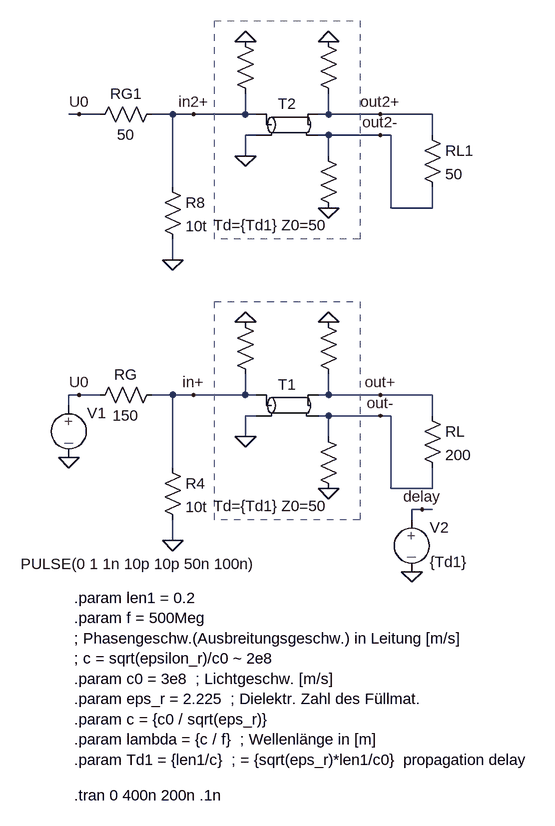
[diagram p0: schematic fehlanpassung_gustrau_S107.asc]
fehlanpassung_gustrau_S107.asc, the LTspice schematic file:
Version 4
SHEET 1 964 728
WIRE 128 -336 112 -336
WIRE 160 -336 128 -336
WIRE 272 -336 240 -336
WIRE 304 -336 272 -336
WIRE 384 -336 384 -368
WIRE 384 -336 304 -336
WIRE 400 -336 384 -336
WIRE 512 -336 512 -368
WIRE 512 -336 496 -336
WIRE 592 -336 512 -336
WIRE 672 -336 592 -336
WIRE 400 -304 384 -304
WIRE 512 -304 496 -304
WIRE 592 -304 512 -304
WIRE 608 -304 592 -304
WIRE 672 -304 672 -336
WIRE 384 -272 384 -304
WIRE 512 -272 512 -304
WIRE 272 -224 272 -336
WIRE 608 -192 608 -304
WIRE 672 -192 672 -224
WIRE 672 -192 608 -192
WIRE 272 -112 272 -144
WIRE 128 96 112 96
WIRE 160 96 128 96
WIRE 272 96 240 96
WIRE 304 96 272 96
WIRE 384 96 384 64
WIRE 384 96 304 96
WIRE 400 96 384 96
WIRE 512 96 512 64
WIRE 512 96 496 96
WIRE 592 96 512 96
WIRE 672 96 592 96
WIRE 112 112 112 96
WIRE 400 128 384 128
WIRE 512 128 496 128
WIRE 592 128 512 128
WIRE 608 128 592 128
WIRE 672 128 672 96
WIRE 384 160 384 128
WIRE 512 160 512 128
WIRE 272 208 272 96
WIRE 608 240 608 128
WIRE 672 240 672 208
WIRE 672 240 608 240
WIRE 656 272 640 272
WIRE 672 272 656 272
WIRE 640 288 640 272
WIRE 272 320 272 288
FLAG 112 192 0
FLAG 384 -16 0
FLAG 512 -16 0
FLAG 512 240 0
FLAG 384 160 0
FLAG 592 96 out+
FLAG 592 128 out-
FLAG 304 96 in+
FLAG 640 368 0
FLAG 656 272 delay
FLAG 272 320 0
FLAG 128 96 U0
FLAG 384 -448 0
FLAG 512 -448 0
FLAG 512 -192 0
FLAG 384 -272 0
FLAG 592 -336 out2+
FLAG 592 -304 out2-
FLAG 304 -336 in2+
FLAG 272 -112 0
FLAG 128 -336 U0
SYMBOL source-V 112 96 R0
WINDOW 3 -74 260 Left 2
WINDOW 123 0 0 Left 2
WINDOW 39 0 0 Left 2
SYMATTR Value PULSE(0 1 1n 10p 10p 50n 100n)
SYMATTR InstName V1
SYMBOL tline 448 112 R0
WINDOW 3 -24 139 Top 2
SYMATTR Value Td={Td1} Z0=50
SYMATTR InstName T1
SYMBOL res 144 112 R270
WINDOW 0 32 56 VTop 2
WINDOW 3 0 56 VBottom 2
SYMATTR InstName RG
SYMATTR Value 150
SYMBOL res 368 -32 R0
WINDOW 0 36 40 Invisible 2
WINDOW 3 36 76 Invisible 2
SYMATTR InstName R1
SYMATTR Value 10t
SYMBOL res 496 -32 R0
WINDOW 0 36 40 Invisible 2
WINDOW 3 36 76 Invisible 2
SYMATTR InstName R2
SYMATTR Value 10t
SYMBOL res 496 144 R0
WINDOW 0 36 40 Invisible 2
WINDOW 3 36 76 Invisible 2
SYMATTR InstName R3
SYMATTR Value 10t
SYMBOL res 656 112 R0
SYMATTR InstName RL
SYMATTR Value 200
SYMBOL source-V 640 272 R0
WINDOW 123 0 0 Left 2
WINDOW 39 0 0 Left 2
SYMATTR InstName V2
SYMATTR Value {Td1}
SYMBOL res 256 192 R0
SYMATTR InstName R4
SYMATTR Value 10t
SYMBOL tline 448 -320 R0
WINDOW 3 -24 139 Top 2
SYMATTR Value Td={Td1} Z0=50
SYMATTR InstName T2
SYMBOL res 144 -320 R270
WINDOW 0 32 56 VTop 2
WINDOW 3 0 56 VBottom 2
SYMATTR InstName RG1
SYMATTR Value 50
SYMBOL res 368 -464 R0
WINDOW 0 36 40 Invisible 2
WINDOW 3 36 76 Invisible 2
SYMATTR InstName R5
SYMATTR Value 10t
SYMBOL res 496 -464 R0
WINDOW 0 36 40 Invisible 2
WINDOW 3 36 76 Invisible 2
SYMATTR InstName R6
SYMATTR Value 10t
SYMBOL res 496 -288 R0
WINDOW 0 36 40 Invisible 2
WINDOW 3 36 76 Invisible 2
SYMATTR InstName R7
SYMATTR Value 10t
SYMBOL res 656 -320 R0
SYMATTR InstName RL1
SYMATTR Value 50
SYMBOL res 256 -240 R0
SYMATTR InstName R8
SYMATTR Value 10t
TEXT 120 408 Left 2 !.param len1 = 0.2\n.param f = 500Meg\n; Phasengeschw.(Ausbreitungsgeschw.) in Leitung [m/s]\n; c = sqrt(epsilon_r)/c0 ~ 2e8\n.param c0 = 3e8  ; Lichtgeschw. [m/s]\n.param eps_r = 2.225  ; Dielektr. Zahl des Füllmat.\n.param c = {c0 / sqrt(eps_r)}\n.param lambda = {c / f}  ; Wellenlänge in [m]\n.param Td1 = {len1/c}  ; = {sqrt(eps_r)*len1/c0}  propagation delay
TEXT 120 712 Left 2 !.tran 0 400n 200n .1n
RECTANGLE Normal 560 288 336 -48 2
RECTANGLE Normal 560 -144 336 -480 2

The netlist it stands for:
* fehlanpassung_gustrau_S107.asc
V1 U0 0 PULSE(0 1 1n 10p 10p 50n 100n)
T1 in+ 0 out+ out- Td={Td1} Z0=50
RG U0 in+ 150
R1 0 in+ 10t
R2 0 out+ 10t
R3 out- 0 10t
RL out+ out- 200
V2 delay 0 {Td1}
R4 in+ 0 10t
T2 in2+ 0 out2+ out2- Td={Td1} Z0=50
RG1 U0 in2+ 50
R5 0 in2+ 10t
R6 0 out2+ 10t
R7 out2- 0 10t
RL1 out2+ out2- 50
R8 in2+ 0 10t
.param len1 = 0.2
.param f = 500Meg
; Phasengeschw.(Ausbreitungsgeschw.) in Leitung [m/s]
; c = sqrt(epsilon_r)/c0 ~ 2e8
.param c0 = 3e8  ; Lichtgeschw. [m/s]
.param eps_r = 2.225  ; Dielektr. Zahl des Füllmat.
.param c = {c0 / sqrt(eps_r)}
.param lambda = {c / f}  ; Wellenlänge in [m]
.param Td1 = {len1/c}  ; = {sqrt(eps_r)*len1/c0}  propagation delay
.tran 0 400n 200n .1n
.backanno
.end